# Altium schematic sheet TEMPSENS.SchDoc
size A4
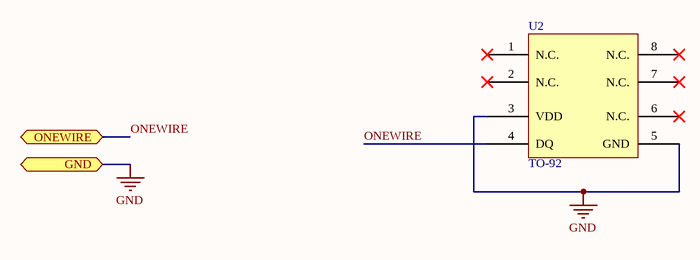
[diagram p0: TEMPSENS.SchDoc]

## Parts
U2  TO-92  [DS18S20]

## Ports
GND, ONEWIRE (bidir)

## Nets
GND: U2.3(VDD) U2.5(GND) ; port GND
ONEWIRE: U2.4(DQ) ; port ONEWIRE

Not connected (* = marked no-connect by the designer): U2 1(N.C.)* 2(N.C.)* 6(N.C.)* 7(N.C.)* 8(N.C.)*

## Library data of the parts
U2 = DS18S20: 1-Wire Digital Thermometer; Manufacturer: Maxim; Manufacturer P/N: DS18S20+; Supplier: Digikey; Supplier P/N: DS18S20Z+T&RCT-ND